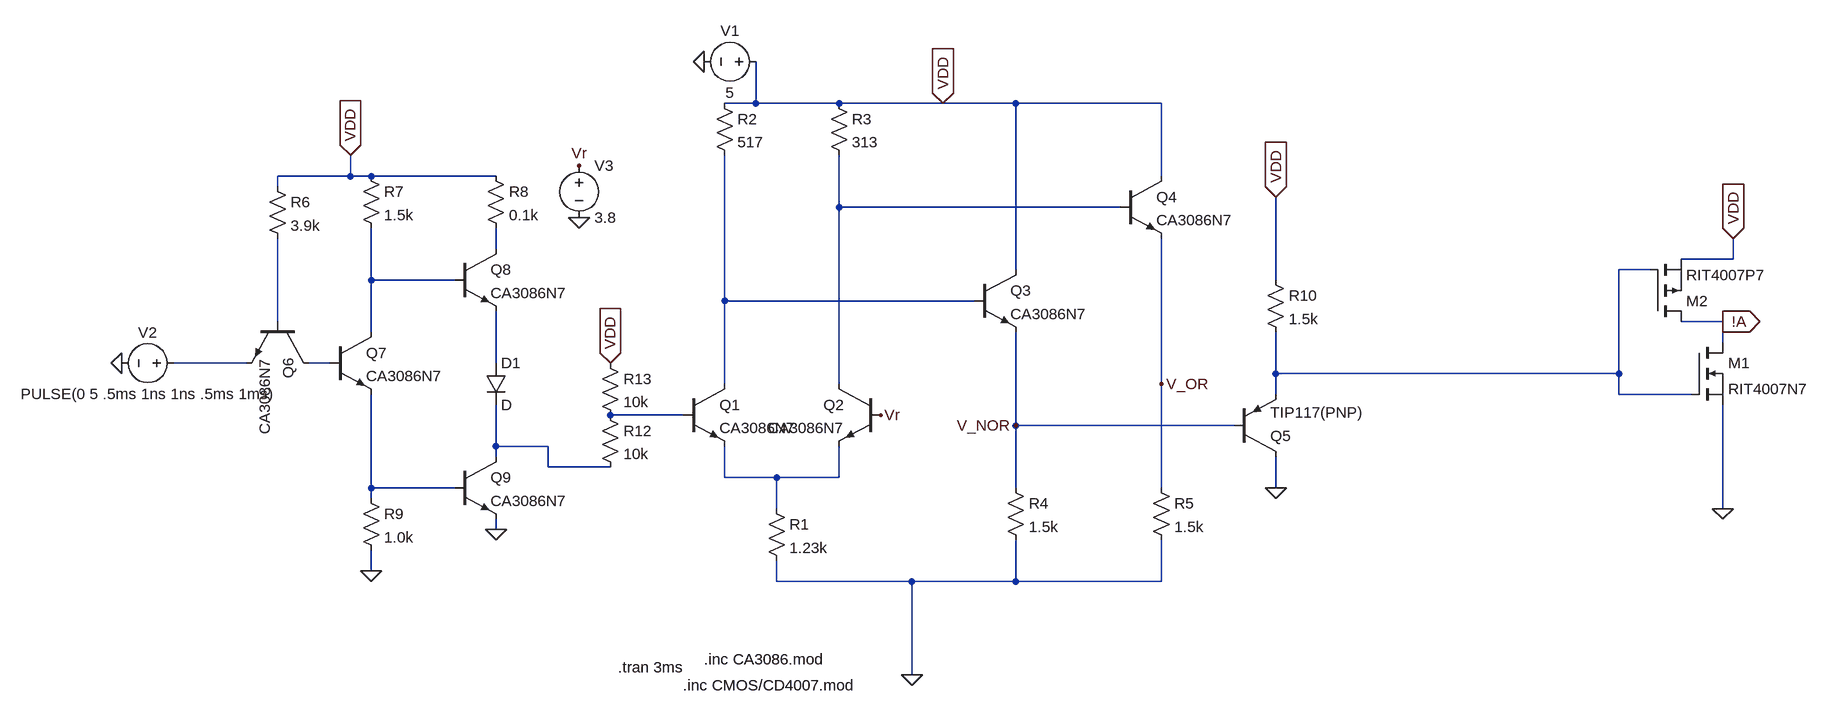
[diagram p0: schematic Lab9.asc]
Lab9.asc, the LTspice schematic file:
Version 4
SHEET 1 1108 1188
WIRE -528 176 -528 112
WIRE -528 176 -576 176
WIRE -400 176 -528 176
WIRE -240 176 -400 176
WIRE -128 176 -240 176
WIRE 96 176 -128 176
WIRE -1152 288 -1152 256
WIRE -1152 288 -1264 288
WIRE -1120 288 -1152 288
WIRE -928 288 -1120 288
WIRE 96 288 96 176
WIRE -1264 304 -1264 288
WIRE -400 336 -400 256
WIRE 32 336 -400 336
WIRE -928 400 -928 368
WIRE 976 416 976 384
WIRE 976 416 896 416
WIRE -128 432 -128 176
WIRE 848 432 800 432
WIRE -1120 448 -1120 368
WIRE -992 448 -1120 448
WIRE 272 448 272 320
WIRE -576 480 -576 256
WIRE -192 480 -576 480
WIRE -1264 512 -1264 384
WIRE 960 512 896 512
WIRE -1120 528 -1120 448
WIRE 960 544 960 512
WIRE -1312 576 -1424 576
WIRE -1184 576 -1216 576
WIRE -928 576 -928 496
WIRE 272 592 272 528
WIRE 800 592 800 432
WIRE 800 592 272 592
WIRE -576 608 -576 480
WIRE -400 608 -400 336
WIRE 96 608 96 384
WIRE 272 624 272 592
WIRE 800 624 800 592
WIRE 912 624 800 624
WIRE -640 656 -752 656
WIRE -128 672 -128 528
WIRE 208 672 -128 672
WIRE -928 704 -928 640
WIRE -848 704 -928 704
WIRE -928 720 -928 704
WIRE -848 736 -848 704
WIRE -752 736 -848 736
WIRE -576 752 -576 704
WIRE -496 752 -576 752
WIRE -400 752 -400 704
WIRE -400 752 -496 752
WIRE -1120 768 -1120 624
WIRE -992 768 -1120 768
WIRE -128 768 -128 672
WIRE 96 768 96 608
WIRE 272 768 272 720
WIRE -1120 784 -1120 768
WIRE -496 800 -496 752
WIRE 960 800 960 640
WIRE -928 832 -928 816
WIRE -1120 896 -1120 864
WIRE -496 912 -496 880
WIRE -288 912 -496 912
WIRE -128 912 -128 848
WIRE -128 912 -288 912
WIRE 96 912 96 848
WIRE 96 912 -128 912
WIRE -288 1056 -288 912
FLAG -288 1056 0
FLAG -336 656 Vr
FLAG -128 672 V_NOR
FLAG 96 608 V_OR
FLAG -1120 896 0
FLAG -928 832 0
FLAG -1152 256 VDD
IOPIN -1152 256 In
FLAG 960 800 0
FLAG 960 512 !A
IOPIN 960 512 Out
FLAG 976 384 VDD
IOPIN 976 384 In
FLAG -608 112 0
FLAG -240 176 VDD
IOPIN -240 176 In
FLAG -1504 576 0
FLAG -800 352 0
FLAG -800 272 Vr
FLAG -752 576 VDD
IOPIN -752 576 In
FLAG 272 320 VDD
IOPIN 272 320 In
FLAG 272 768 0
SYMBOL npn -640 608 R0
SYMATTR InstName Q1
SYMATTR Value CA3086N7
SYMBOL npn -336 608 M0
SYMATTR InstName Q2
SYMATTR Value CA3086N7
SYMBOL npn -192 432 R0
SYMATTR InstName Q3
SYMATTR Value CA3086N7
SYMBOL npn 32 288 R0
SYMATTR InstName Q4
SYMATTR Value CA3086N7
SYMBOL res -512 784 R0
SYMATTR InstName R1
SYMATTR Value 1.23k
SYMBOL res -592 160 R0
SYMATTR InstName R2
SYMATTR Value 517
SYMBOL res -416 160 R0
SYMATTR InstName R3
SYMATTR Value 313
SYMBOL res -144 752 R0
SYMATTR InstName R4
SYMATTR Value 1.5k
SYMBOL res 80 752 R0
SYMATTR InstName R5
SYMATTR Value 1.5k
SYMBOL npn -1216 512 R90
SYMATTR InstName Q6
SYMATTR Value CA3086N7
SYMBOL npn -1184 528 R0
SYMATTR InstName Q7
SYMATTR Value CA3086N7
SYMBOL npn -992 400 R0
SYMATTR InstName Q8
SYMATTR Value CA3086N7
SYMBOL npn -992 720 R0
SYMATTR InstName Q9
SYMATTR Value CA3086N7
SYMBOL diode -944 576 R0
SYMATTR InstName D1
SYMBOL res -1280 288 R0
SYMATTR InstName R6
SYMATTR Value 3.9k
SYMBOL res -1136 272 R0
SYMATTR InstName R7
SYMATTR Value 1.5k
SYMBOL res -944 272 R0
SYMATTR InstName R8
SYMATTR Value 0.1k
SYMBOL res -1136 768 R0
SYMATTR InstName R9
SYMATTR Value 1.0k
SYMBOL nmos 912 544 R0
SYMATTR InstName M1
SYMATTR Value RIT4007N7
SYMBOL pmos 848 512 M180
SYMATTR InstName M2
SYMATTR Value RIT4007P7
SYMBOL voltage -512 112 R90
WINDOW 0 -32 56 VBottom 2
WINDOW 3 32 56 VTop 2
WINDOW 123 0 0 Left 2
WINDOW 39 0 0 Left 2
SYMATTR InstName V1
SYMATTR Value 5
SYMBOL voltage -1408 576 R90
WINDOW 0 -32 56 VBottom 2
WINDOW 3 32 56 VTop 2
WINDOW 123 0 0 Left 2
WINDOW 39 0 0 Left 2
SYMATTR InstName V2
SYMATTR Value PULSE(0 5 .5ms 1ns 1ns .5ms 1ms)
SYMBOL voltage -800 256 R0
WINDOW 123 0 0 Left 2
WINDOW 39 0 0 Left 2
SYMATTR InstName V3
SYMATTR Value 3.8
SYMBOL res -768 640 R0
SYMATTR InstName R12
SYMATTR Value 10k
SYMBOL res -768 560 R0
SYMATTR InstName R13
SYMATTR Value 10k
SYMBOL pnp 208 720 M180
SYMATTR InstName Q5
SYMATTR Value TIP117(PNP)
SYMBOL res 256 432 R0
SYMATTR InstName R10
SYMATTR Value 1.5k
TEXT -608 1032 Left 2 !.inc CA3086.mod
TEXT -640 1072 Left 2 !.inc CMOS/CD4007.mod
TEXT -740 1044 Left 2 !.tran 3ms

The netlist it stands for:
* Lab9.asc
Q1 N005 N010 N012 0 CA3086N7
Q2 N001 Vr N012 0 CA3086N7
Q3 VDD N005 V_NOR 0 CA3086N7
Q4 VDD N001 V_OR 0 CA3086N7
R1 N012 0 1.23k
R2 VDD N005 517
R3 VDD N001 313
R4 V_NOR 0 1.5k
R5 V_OR 0 1.5k
Q6 N008 N006 N007 0 CA3086N7
Q7 N004 N008 N013 0 CA3086N7
Q8 N002 N004 N009 0 CA3086N7
Q9 N011 N013 0 0 CA3086N7
D1 N009 N011 D
R6 VDD N006 3.9k
R7 VDD N004 1.5k
R8 VDD N002 0.1k
R9 N013 0 1.0k
M1 !A N003 0 0 RIT4007N7
M2 !A N003 VDD VDD RIT4007P7
V1 VDD 0 5
V2 N007 0 PULSE(0 5 .5ms 1ns 1ns .5ms 1ms)
V3 Vr 0 3.8
R12 N010 N011 10k
R13 VDD N010 10k
Q5 0 V_NOR N003 0 TIP117(PNP)
R10 VDD N003 1.5k
.model D D
.lib standard.dio
.model NPN NPN
.model PNP PNP
.lib standard.bjt
.model NMOS NMOS
.model PMOS PMOS
.lib standard.mos
.inc CA3086.mod
.inc CMOS/CD4007.mod
.tran 3ms
.backanno
.end